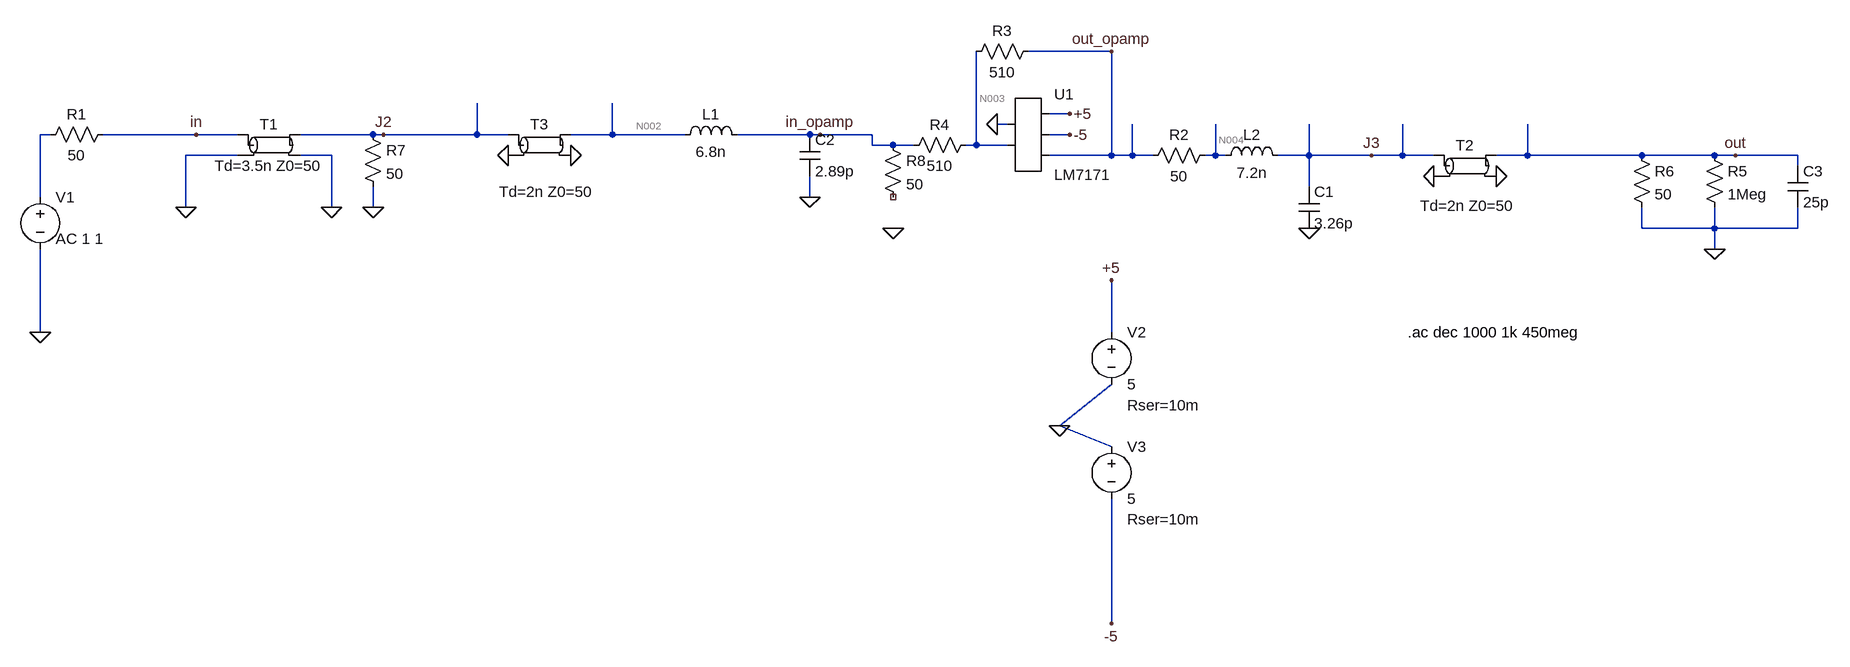
[diagram p0: schematic Symulacja drogi pomiaru.asc]
* Symulacja drogi pomiaru.asc
R1 in N001 50
T1 in 0 J2 0 Td=3.5n Z0=50
L1 N002 in_opamp 6.8n Rser=1m
L2 N004 J3 7.2n Rser=1m
C1 J3 0 3.26p
R2 N004 out_opamp 50
T2 J3 0 out 0 Td=2n Z0=50
C2 in_opamp 0 2.89p
* U1: LM7171 (symbol AutoGenerated\LM7171 not available, pins judged from their places): pin1=0 pin2=N003 pin3=+5 pin4=-5 pin5=out_opamp
V2 +5 0 5 Rser=10m
V3 0 -5 5 Rser=10m
R3 out_opamp N003 510
R4 N003 in_opamp 510
R5 out 0 1Meg
C3 out 0 25p
V1 N001 0 AC 1 1
R6 out 0 50
R7 J2 0 50
T3 J2 0 N002 0 Td=2n Z0=50
R8 in_opamp NC_01 50
.ac dec 1000 1k 450meg
.backanno
.end

* Results of the author's LTspice run, read from the files saved beside the schematic
* Operating Point, zero values left out:
*   V(+5) = 5 V
*   V(-5) = -5 V
*   V(in) = 43.88 µV
*   V(in_opamp) = 43.89 µV
*   V(j2) = 43.88 µV
*   V(j3) = 1.673 mV
*   V(n002) = 43.88 µV
*   V(n003) = 939.1 µV
*   V(n004) = 1.673 mV
*   V(out) = 1.673 mV
*   V(out_opamp) = 3.346 mV
*   I(L1) = -1.755 µA
*   I(L2) = 33.46 µA
*   I(R1) = 877.7 nA
*   I(R2) = -33.46 µA
*   I(R3) = 4.72 µA
*   I(R4) = 1.755 µA
*   I(R5) = 1.673 nA
*   I(R6) = 33.46 µA
*   I(R7) = 877.7 nA
*   I(V1) = 877.7 nA
*   I(V2) = -5.738 mA
*   I(V3) = -5.706 mA
*   Ia(T1) = -877.7 nA
*   Ia(T2) = 33.46 µA
*   Ia(T3) = -1.755 µA
*   Ib(T1) = 877.7 nA
*   Ib(T2) = -33.46 µA
*   Ib(T3) = 1.755 µA
*   Ic(T1) = 877.7 nA
*   Ic(T2) = -33.46 µA
*   Ic(T3) = 1.755 µA
*   Id(T1) = -877.7 nA
*   Id(T2) = 33.46 µA
*   Id(T3) = -1.755 µA
*   Ix(u1:2) = 2.964 µA
*   Ix(u1:3) = 3.065 µA
*   Ix(u1:4) = 5.738 mA
*   Ix(u1:5) = -5.706 mA
*   Ix(u1:6) = -38.18 µA
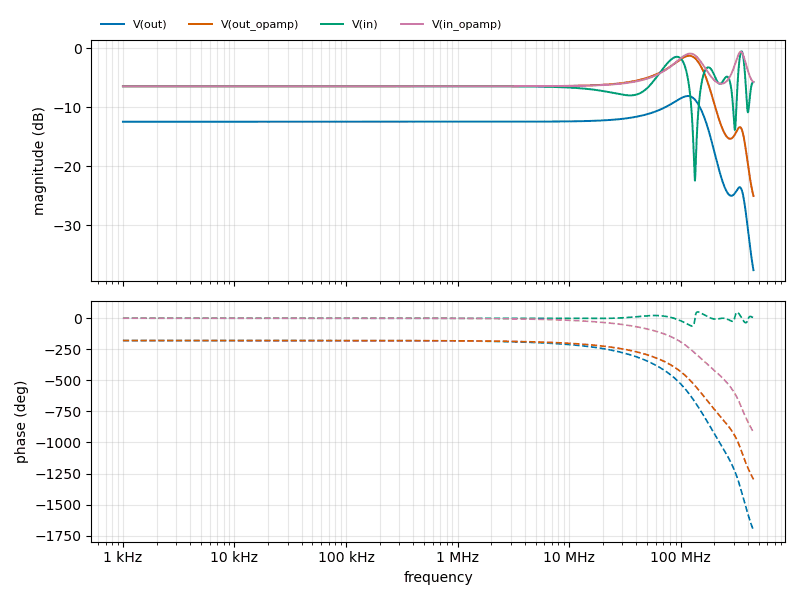
[diagram p1: AC Analysis of Symulacja drogi pomiaru.asc, plotted from the saved traces]
* AC Analysis, 1 run:
*   V(out): -12.46 dB at 1 kHz, -37.66 dB at 450 MHz, peak -8.09 dB at 116.1 MHz, 3 dB below the peak at 51.85 MHz and 158.3 MHz
*   V(out_opamp): -6.44 dB at 1 kHz, -25.06 dB at 450 MHz, peak -1.26 dB at 119.7 MHz, 3 dB below the peak at 62.84 MHz and 163.2 MHz
*   V(in): -6.44 dB at 1 kHz, -5.73 dB at 450 MHz, peak -0.50 dB at 351.6 MHz, 3 dB below the peak at 330.9 MHz and 374.5 MHz
*   V(in_opamp): -6.44 dB at 1 kHz, -5.72 dB at 450 MHz, peak -0.57 dB at 345.9 MHz, 3 dB below the peak at 296 MHz and 397.5 MHz